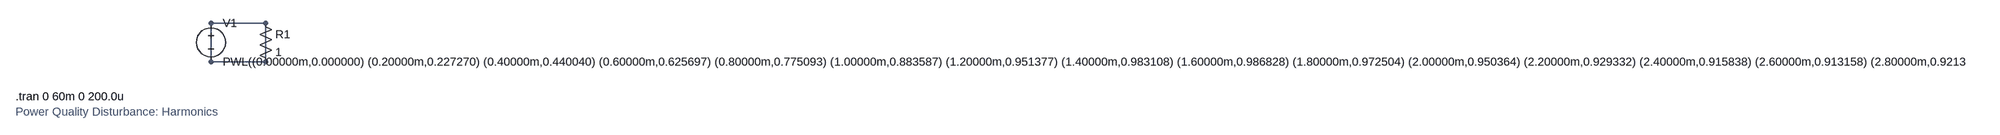
[diagram p0: schematic Harmonics.asc]
Harmonics.asc, the LTspice schematic file:
Version 4
SHEET 1 880 680
WIRE 192 128 80 128
WIRE 80 128 80 208
WIRE 192 208 80 208
WIRE 192 128 192 208
SYMBOL voltage 80 112 R0
WINDOW 123 0 0 Left 0
WINDOW 39 0 0 Left 0
SYMATTR InstName V1
SYMATTR Value PWL((0.00000m,0.000000) (0.20000m,0.227270) (0.40000m,0.440040) (0.60000m,0.625697) (0.80000m,0.775093) (1.00000m,0.883587) (1.20000m,0.951377) (1.40000m,0.983108) (1.60000m,0.986828) (1.80000m,0.972504) (2.00000m,0.950364) (2.20000m,0.929332) (2.40000m,0.915838) (2.60000m,0.913158) (2.80000m,0.921372) (3.00000m,0.937893) (3.20000m,0.958431) (3.40000m,0.978169) (3.60000m,0.992914) (3.80000m,1.000000) (4.00000m,0.998774) (4.20000m,0.990603) (4.40000m,0.978422) (4.60000m,0.965947) (4.80000m,0.956747) (5.00000m,0.953372) (5.20000m,0.956747) (5.40000m,0.965947) (5.60000m,0.978422) (5.80000m,0.990603) (6.00000m,0.998774) (6.20000m,1.000000) (6.40000m,0.992914) (6.60000m,0.978169) (6.80000m,0.958431) (7.00000m,0.937893) (7.20000m,0.921372) (7.40000m,0.913158) (7.60000m,0.915838) (7.80000m,0.929332) (8.00000m,0.950364) (8.20000m,0.972504) (8.40000m,0.986828) (8.60000m,0.983108) (8.80000m,0.951377) (9.00000m,0.883587) (9.20000m,0.775093) (9.40000m,0.625697) (9.60000m,0.440040) (9.80000m,0.227270) (10.00000m,0.000000) (10.20000m,-0.227270) (10.40000m,-0.440040) (10.60000m,-0.625697) (10.80000m,-0.775093) (11.00000m,-0.883587) (11.20000m,-0.951377) (11.40000m,-0.983108) (11.60000m,-0.986828) (11.80000m,-0.972504) (12.00000m,-0.950364) (12.20000m,-0.929332) (12.40000m,-0.915838) (12.60000m,-0.913158) (12.80000m,-0.921372) (13.00000m,-0.937893) (13.20000m,-0.958431) (13.40000m,-0.978169) (13.60000m,-0.992914) (13.80000m,-1.000000) (14.00000m,-0.998774) (14.20000m,-0.990603) (14.40000m,-0.978422) (14.60000m,-0.965947) (14.80000m,-0.956747) (15.00000m,-0.953372) (15.20000m,-0.956747) (15.40000m,-0.965947) (15.60000m,-0.978422) (15.80000m,-0.990603) (16.00000m,-0.998774) (16.20000m,-1.000000) (16.40000m,-0.992914) (16.60000m,-0.978169) (16.80000m,-0.958431) (17.00000m,-0.937893) (17.20000m,-0.921372) (17.40000m,-0.913158) (17.60000m,-0.915838) (17.80000m,-0.929332) (18.00000m,-0.950364) (18.20000m,-0.972504) (18.40000m,-0.986828) (18.60000m,-0.983108) (18.80000m,-0.951377) (19.00000m,-0.883587) (19.20000m,-0.775093) (19.40000m,-0.625697) (19.60000m,-0.440040) (19.80000m,-0.227270) (20.00000m,-0.000000) (20.20000m,0.227270) (20.40000m,0.440040) (20.60000m,0.625697) (20.80000m,0.775093) (21.00000m,0.883587) (21.20000m,0.951377) (21.40000m,0.983108) (21.60000m,0.986828) (21.80000m,0.972504) (22.00000m,0.950364) (22.20000m,0.929332) (22.40000m,0.915838) (22.60000m,0.913158) (22.80000m,0.921372) (23.00000m,0.937893) (23.20000m,0.958431) (23.40000m,0.978169) (23.60000m,0.992914) (23.80000m,1.000000) (24.00000m,0.998774) (24.20000m,0.990603) (24.40000m,0.978422) (24.60000m,0.965947) (24.80000m,0.956747) (25.00000m,0.953372) (25.20000m,0.956747) (25.40000m,0.965947) (25.60000m,0.978422) (25.80000m,0.990603) (26.00000m,0.998774) (26.20000m,1.000000) (26.40000m,0.992914) (26.60000m,0.978169) (26.80000m,0.958431) (27.00000m,0.937893) (27.20000m,0.921372) (27.40000m,0.913158) (27.60000m,0.915838) (27.80000m,0.929332) (28.00000m,0.950364) (28.20000m,0.972504) (28.40000m,0.986828) (28.60000m,0.983108) (28.80000m,0.951377) (29.00000m,0.883587) (29.20000m,0.775093) (29.40000m,0.625697) (29.60000m,0.440040) (29.80000m,0.227270) (30.00000m,0.000000) (30.20000m,-0.227270) (30.40000m,-0.440040) (30.60000m,-0.625697) (30.80000m,-0.775093) (31.00000m,-0.883587) (31.20000m,-0.951377) (31.40000m,-0.983108) (31.60000m,-0.986828) (31.80000m,-0.972504) (32.00000m,-0.950364) (32.20000m,-0.929332) (32.40000m,-0.915838) (32.60000m,-0.913158) (32.80000m,-0.921372) (33.00000m,-0.937893) (33.20000m,-0.958431) (33.40000m,-0.978169) (33.60000m,-0.992914) (33.80000m,-1.000000) (34.00000m,-0.998774) (34.20000m,-0.990603) (34.40000m,-0.978422) (34.60000m,-0.965947) (34.80000m,-0.956747) (35.00000m,-0.953372) (35.20000m,-0.956747) (35.40000m,-0.965947) (35.60000m,-0.978422) (35.80000m,-0.990603) (36.00000m,-0.998774) (36.20000m,-1.000000) (36.40000m,-0.992914) (36.60000m,-0.978169) (36.80000m,-0.958431) (37.00000m,-0.937893) (37.20000m,-0.921372) (37.40000m,-0.913158) (37.60000m,-0.915838) (37.80000m,-0.929332) (38.00000m,-0.950364) (38.20000m,-0.972504) (38.40000m,-0.986828) (38.60000m,-0.983108) (38.80000m,-0.951377) (39.00000m,-0.883587) (39.20000m,-0.775093) (39.40000m,-0.625697) (39.60000m,-0.440040) (39.80000m,-0.227270) (40.00000m,-0.000000) (40.20000m,0.227270) (40.40000m,0.440040) (40.60000m,0.625697) (40.80000m,0.775093) (41.00000m,0.883587) (41.20000m,0.951377) (41.40000m,0.983108) (41.60000m,0.986828) (41.80000m,0.972504) (42.00000m,0.950364) (42.20000m,0.929332) (42.40000m,0.915838) (42.60000m,0.913158) (42.80000m,0.921372) (43.00000m,0.937893) (43.20000m,0.958431) (43.40000m,0.978169) (43.60000m,0.992914) (43.80000m,1.000000) (44.00000m,0.998774) (44.20000m,0.990603) (44.40000m,0.978422) (44.60000m,0.965947) (44.80000m,0.956747) (45.00000m,0.953372) (45.20000m,0.956747) (45.40000m,0.965947) (45.60000m,0.978422) (45.80000m,0.990603) (46.00000m,0.998774) (46.20000m,1.000000) (46.40000m,0.992914) (46.60000m,0.978169) (46.80000m,0.958431) (47.00000m,0.937893) (47.20000m,0.921372) (47.40000m,0.913158) (47.60000m,0.915838) (47.80000m,0.929332) (48.00000m,0.950364) (48.20000m,0.972504) (48.40000m,0.986828) (48.60000m,0.983108) (48.80000m,0.951377) (49.00000m,0.883587) (49.20000m,0.775093) (49.40000m,0.625697) (49.60000m,0.440040) (49.80000m,0.227270) (50.00000m,0.000000) (50.20000m,-0.227270) (50.40000m,-0.440040) (50.60000m,-0.625697) (50.80000m,-0.775093) (51.00000m,-0.883587) (51.20000m,-0.951377) (51.40000m,-0.983108) (51.60000m,-0.986828) (51.80000m,-0.972504) (52.00000m,-0.950364) (52.20000m,-0.929332) (52.40000m,-0.915838) (52.60000m,-0.913158) (52.80000m,-0.921372) (53.00000m,-0.937893) (53.20000m,-0.958431) (53.40000m,-0.978169) (53.60000m,-0.992914) (53.80000m,-1.000000) (54.00000m,-0.998774) (54.20000m,-0.990603) (54.40000m,-0.978422) (54.60000m,-0.965947) (54.80000m,-0.956747) (55.00000m,-0.953372) (55.20000m,-0.956747) (55.40000m,-0.965947) (55.60000m,-0.978422) (55.80000m,-0.990603) (56.00000m,-0.998774) (56.20000m,-1.000000) (56.40000m,-0.992914) (56.60000m,-0.978169) (56.80000m,-0.958431) (57.00000m,-0.937893) (57.20000m,-0.921372) (57.40000m,-0.913158) (57.60000m,-0.915838) (57.80000m,-0.929332) (58.00000m,-0.950364) (58.20000m,-0.972504) (58.40000m,-0.986828) (58.60000m,-0.983108) (58.80000m,-0.951377) (59.00000m,-0.883587) (59.20000m,-0.775093) (59.40000m,-0.625697) (59.60000m,-0.440040) (59.80000m,-0.227270))
SYMBOL res 176 112 R0
SYMATTR InstName R1
SYMATTR Value 1
TEXT -320 280 Left 2 !.tran 0 60m 0 200.0u
TEXT -320 312 Left 2 ;Power Quality Disturbance: Harmonics

The netlist it stands for:
* Harmonics.asc
V1 N001 N001 PWL((0.00000m,0.000000) (0.20000m,0.227270) (0.40000m,0.440040) (0.60000m,0.625697) (0.80000m,0.775093) (1.00000m,0.883587) (1.20000m,0.951377) (1.40000m,0.983108) (1.60000m,0.986828) (1.80000m,0.972504) (2.00000m,0.950364) (2.20000m,0.929332) (2.40000m,0.915838) (2.60000m,0.913158) (2.80000m,0.921372) (3.00000m,0.937893) (3.20000m,0.958431) (3.40000m,0.978169) (3.60000m,0.992914) (3.80000m,1.000000) (4.00000m,0.998774) (4.20000m,0.990603) (4.40000m,0.978422) (4.60000m,0.965947) (4.80000m,0.956747) (5.00000m,0.953372) (5.20000m,0.956747) (5.40000m,0.965947) (5.60000m,0.978422) (5.80000m,0.990603) (6.00000m,0.998774) (6.20000m,1.000000) (6.40000m,0.992914) (6.60000m,0.978169) (6.80000m,0.958431) (7.00000m,0.937893) (7.20000m,0.921372) (7.40000m,0.913158) (7.60000m,0.915838) (7.80000m,0.929332) (8.00000m,0.950364) (8.20000m,0.972504) (8.40000m,0.986828) (8.60000m,0.983108) (8.80000m,0.951377) (9.00000m,0.883587) (9.20000m,0.775093) (9.40000m,0.625697) (9.60000m,0.440040) (9.80000m,0.227270) (10.00000m,0.000000) (10.20000m,-0.227270) (10.40000m,-0.440040) (10.60000m,-0.625697) (10.80000m,-0.775093) (11.00000m,-0.883587) (11.20000m,-0.951377) (11.40000m,-0.983108) (11.60000m,-0.986828) (11.80000m,-0.972504) (12.00000m,-0.950364) (12.20000m,-0.929332) (12.40000m,-0.915838) (12.60000m,-0.913158) (12.80000m,-0.921372) (13.00000m,-0.937893) (13.20000m,-0.958431) (13.40000m,-0.978169) (13.60000m,-0.992914) (13.80000m,-1.000000) (14.00000m,-0.998774) (14.20000m,-0.990603) (14.40000m,-0.978422) (14.60000m,-0.965947) (14.80000m,-0.956747) (15.00000m,-0.953372) (15.20000m,-0.956747) (15.40000m,-0.965947) (15.60000m,-0.978422) (15.80000m,-0.990603) (16.00000m,-0.998774) (16.20000m,-1.000000) (16.40000m,-0.992914) (16.60000m,-0.978169) (16.80000m,-0.958431) (17.00000m,-0.937893) (17.20000m,-0.921372) (17.40000m,-0.913158) (17.60000m,-0.915838) (17.80000m,-0.929332) (18.00000m,-0.950364) (18.20000m,-0.972504) (18.40000m,-0.986828) (18.60000m,-0.983108) (18.80000m,-0.951377) (19.00000m,-0.883587) (19.20000m,-0.775093) (19.40000m,-0.625697) (19.60000m,-0.440040) (19.80000m,-0.227270) (20.00000m,-0.000000) (20.20000m,0.227270) (20.40000m,0.440040) (20.60000m,0.625697) (20.80000m,0.775093) (21.00000m,0.883587) (21.20000m,0.951377) (21.40000m,0.983108) (21.60000m,0.986828) (21.80000m,0.972504) (22.00000m,0.950364) (22.20000m,0.929332) (22.40000m,0.915838) (22.60000m,0.913158) (22.80000m,0.921372) (23.00000m,0.937893) (23.20000m,0.958431) (23.40000m,0.978169) (23.60000m,0.992914) (23.80000m,1.000000) (24.00000m,0.998774) (24.20000m,0.990603) (24.40000m,0.978422) (24.60000m,0.965947) (24.80000m,0.956747) (25.00000m,0.953372) (25.20000m,0.956747) (25.40000m,0.965947) (25.60000m,0.978422) (25.80000m,0.990603) (26.00000m,0.998774) (26.20000m,1.000000) (26.40000m,0.992914) (26.60000m,0.978169) (26.80000m,0.958431) (27.00000m,0.937893) (27.20000m,0.921372) (27.40000m,0.913158) (27.60000m,0.915838) (27.80000m,0.929332) (28.00000m,0.950364) (28.20000m,0.972504) (28.40000m,0.986828) (28.60000m,0.983108) (28.80000m,0.951377) (29.00000m,0.883587) (29.20000m,0.775093) (29.40000m,0.625697) (29.60000m,0.440040) (29.80000m,0.227270) (30.00000m,0.000000) (30.20000m,-0.227270) (30.40000m,-0.440040) (30.60000m,-0.625697) (30.80000m,-0.775093) (31.00000m,-0.883587) (31.20000m,-0.951377) (31.40000m,-0.983108) (31.60000m,-0.986828) (31.80000m,-0.972504) (32.00000m,-0.950364) (32.20000m,-0.929332) (32.40000m,-0.915838) (32.60000m,-0.913158) (32.80000m,-0.921372) (33.00000m,-0.937893) (33.20000m,-0.958431) (33.40000m,-0.978169) (33.60000m,-0.992914) (33.80000m,-1.000000) (34.00000m,-0.998774) (34.20000m,-0.990603) (34.40000m,-0.978422) (34.60000m,-0.965947) (34.80000m,-0.956747) (35.00000m,-0.953372) (35.20000m,-0.956747) (35.40000m,-0.965947) (35.60000m,-0.978422) (35.80000m,-0.990603) (36.00000m,-0.998774) (36.20000m,-1.000000) (36.40000m,-0.992914) (36.60000m,-0.978169) (36.80000m,-0.958431) (37.00000m,-0.937893) (37.20000m,-0.921372) (37.40000m,-0.913158) (37.60000m,-0.915838) (37.80000m,-0.929332) (38.00000m,-0.950364) (38.20000m,-0.972504) (38.40000m,-0.986828) (38.60000m,-0.983108) (38.80000m,-0.951377) (39.00000m,-0.883587) (39.20000m,-0.775093) (39.40000m,-0.625697) (39.60000m,-0.440040) (39.80000m,-0.227270) (40.00000m,-0.000000) (40.20000m,0.227270) (40.40000m,0.440040) (40.60000m,0.625697) (40.80000m,0.775093) (41.00000m,0.883587) (41.20000m,0.951377) (41.40000m,0.983108) (41.60000m,0.986828) (41.80000m,0.972504) (42.00000m,0.950364) (42.20000m,0.929332) (42.40000m,0.915838) (42.60000m,0.913158) (42.80000m,0.921372) (43.00000m,0.937893) (43.20000m,0.958431) (43.40000m,0.978169) (43.60000m,0.992914) (43.80000m,1.000000) (44.00000m,0.998774) (44.20000m,0.990603) (44.40000m,0.978422) (44.60000m,0.965947) (44.80000m,0.956747) (45.00000m,0.953372) (45.20000m,0.956747) (45.40000m,0.965947) (45.60000m,0.978422) (45.80000m,0.990603) (46.00000m,0.998774) (46.20000m,1.000000) (46.40000m,0.992914) (46.60000m,0.978169) (46.80000m,0.958431) (47.00000m,0.937893) (47.20000m,0.921372) (47.40000m,0.913158) (47.60000m,0.915838) (47.80000m,0.929332) (48.00000m,0.950364) (48.20000m,0.972504) (48.40000m,0.986828) (48.60000m,0.983108) (48.80000m,0.951377) (49.00000m,0.883587) (49.20000m,0.775093) (49.40000m,0.625697) (49.60000m,0.440040) (49.80000m,0.227270) (50.00000m,0.000000) (50.20000m,-0.227270) (50.40000m,-0.440040) (50.60000m,-0.625697) (50.80000m,-0.775093) (51.00000m,-0.883587) (51.20000m,-0.951377) (51.40000m,-0.983108) (51.60000m,-0.986828) (51.80000m,-0.972504) (52.00000m,-0.950364) (52.20000m,-0.929332) (52.40000m,-0.915838) (52.60000m,-0.913158) (52.80000m,-0.921372) (53.00000m,-0.937893) (53.20000m,-0.958431) (53.40000m,-0.978169) (53.60000m,-0.992914) (53.80000m,-1.000000) (54.00000m,-0.998774) (54.20000m,-0.990603) (54.40000m,-0.978422) (54.60000m,-0.965947) (54.80000m,-0.956747) (55.00000m,-0.953372) (55.20000m,-0.956747) (55.40000m,-0.965947) (55.60000m,-0.978422) (55.80000m,-0.990603) (56.00000m,-0.998774) (56.20000m,-1.000000) (56.40000m,-0.992914) (56.60000m,-0.978169) (56.80000m,-0.958431) (57.00000m,-0.937893) (57.20000m,-0.921372) (57.40000m,-0.913158) (57.60000m,-0.915838) (57.80000m,-0.929332) (58.00000m,-0.950364) (58.20000m,-0.972504) (58.40000m,-0.986828) (58.60000m,-0.983108) (58.80000m,-0.951377) (59.00000m,-0.883587) (59.20000m,-0.775093) (59.40000m,-0.625697) (59.60000m,-0.440040) (59.80000m,-0.227270))
R1 N001 N001 1
.tran 0 60m 0 200.0u
* Power Quality Disturbance: Harmonics
.backanno
.end